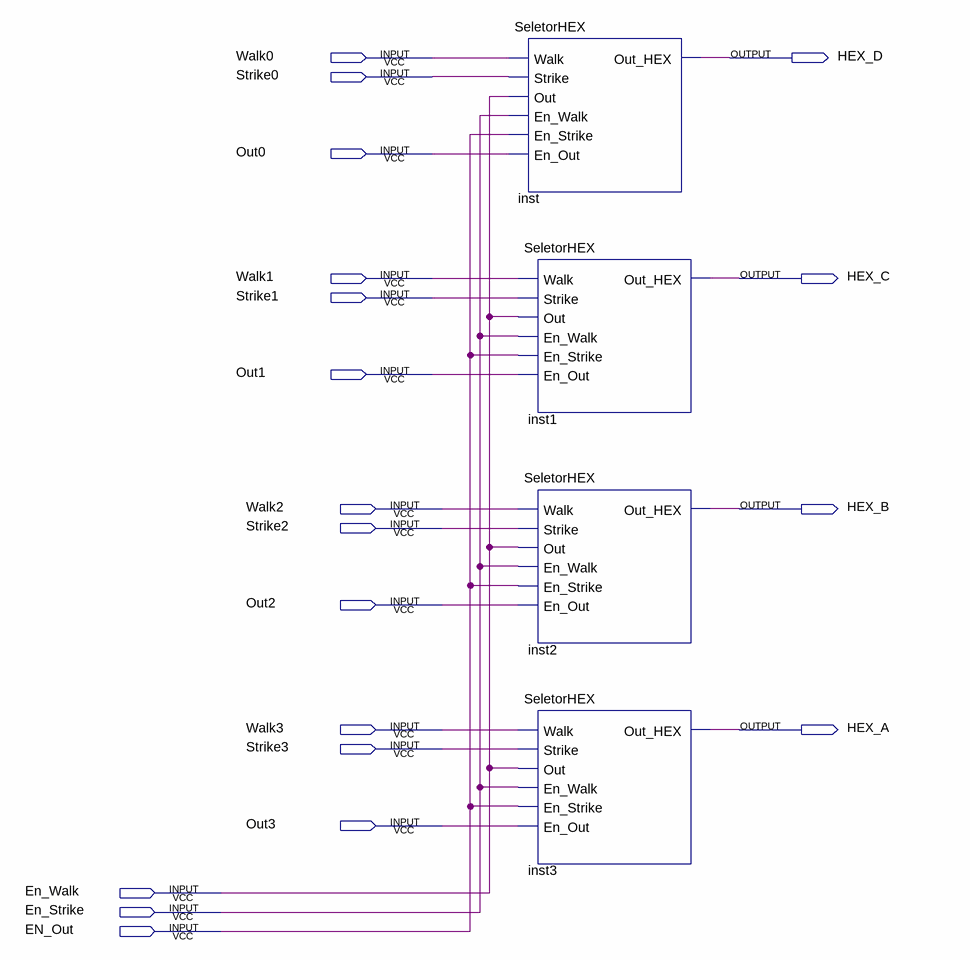
[diagram p0: schematic sheet]
// Quartus schematic SeletorHEXCompleto.bdf as structural Verilog: 4 symbols, 19 pins
module SeletorHEXCompleto (
  input  Walk0,
  input  Strike0,
  input  Out0,
  input  Walk1,
  input  Strike1,
  input  Out1,
  input  Walk2,
  input  Strike2,
  input  Out2,
  input  Walk3,
  input  Strike3,
  input  Out3,
  input  En_Walk,
  input  En_Strike,
  input  EN_Out,
  output HEX_D,
  output HEX_C,
  output HEX_B,
  output HEX_A
);

  SeletorHEX inst (
    .Walk(Walk0), .Strike(Strike0), .Out(En_Walk), .En_Walk(En_Strike), .En_Strike(EN_Out), .En_Out(Out0),
    .Out_HEX(HEX_D));
  SeletorHEX inst1 (
    .Walk(Walk1), .Strike(Strike1), .Out(En_Walk), .En_Walk(En_Strike), .En_Strike(EN_Out), .En_Out(Out1),
    .Out_HEX(HEX_C));
  SeletorHEX inst2 (
    .Walk(Walk2), .Strike(Strike2), .Out(En_Walk), .En_Walk(En_Strike), .En_Strike(EN_Out), .En_Out(Out2),
    .Out_HEX(HEX_B));
  SeletorHEX inst3 (
    .Walk(Walk3), .Strike(Strike3), .Out(En_Walk), .En_Walk(En_Strike), .En_Strike(EN_Out), .En_Out(Out3),
    .Out_HEX(HEX_A));
endmodule
